# Altium schematic sheet USB.SchDoc
size A4; SheetNumber: 4; SheetTotal: 5
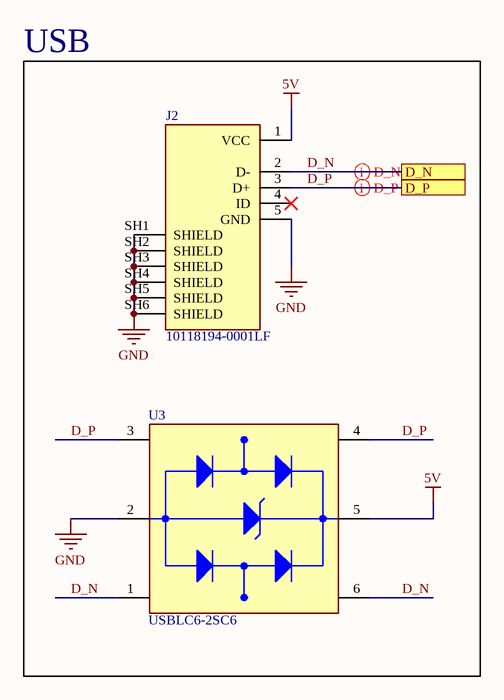
[diagram p0: USB.SchDoc]

## Parts
J2  10118194-0001LF  [AMPHENOL_10118194-0001LF]
U3  USBLC6-2SC6  [SOT95P280X145-6N]

## Blocks framed on the sheet
USB: J2 U3

## Ports
D_N, D_P

## Nets
5V: J2.1(VCC) U3.5(VBUS)
GND: J2.5(GND) J2.SH1(SHIELD) J2.SH2(SHIELD) J2.SH3(SHIELD) J2.SH4(SHIELD) J2.SH5(SHIELD) J2.SH6(SHIELD) U3.2(GND)
D_N: J2.2(D-) U3.1(I/O1_IN) U3.6(I/O1_OUT) ; port D_N
D_P: J2.3(D+) U3.3(I/O2_IN) U3.4(I/O2_OUT) ; port D_P

Not connected (* = marked no-connect by the designer): J2 4(ID)*

## Layout directives
differential pair: D_N, D_P

## Library data of the parts
J2 = 10118194-0001LF: Micro USB, Input Output Connectors, B TYPE RECEPTACLE with flange; MF: Amphenol ICC; SnapEDA_Link: https://www.snapeda.com/parts/10118194-0001LF/Amphenol+FCI/view-part/?ref=snap; Package: None; Value: *; MP: 10118194-0001LF; Check_prices: https://www.snapeda.com/parts/10118194-0001LF/Amphenol+FCI/view-part/?ref=eda
U3 = USBLC6-2SC6: 17V Clamp 5A (8/20Âµs) Ipp Tvs Diode Surface Mount SOT-23-6; MF: STMicroelectronics; Value: *; SnapEDA_Link: https://www.snapeda.com/parts/USBLC6-2SC6/STMicroelectronics/view-part/?ref=snap; Check_prices: https://www.snapeda.com/parts/USBLC6-2SC6/STMicroelectronics/view-part/?ref=eda; Purchase-URL: https://pricing.snapeda.com/search/part/USBLC6-2SC6/?ref=eda; Price: None; Availability: In Stock; Package: SOT-23-6 STMicroelectronics; MP: USBLC6-2SC6